# EAGLE design connector_hub (EAGLE 9.2.2)
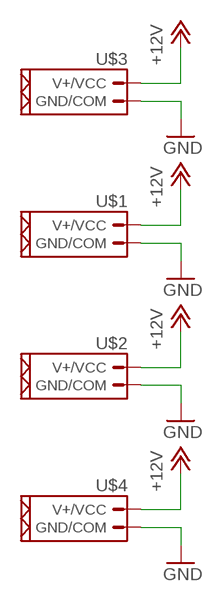
[diagram p0: schematic, sheet 1]

## Parts
U$1  CONN_02_PUIXT60  [XT60]
U$2  CONN_02_PUIXT60  [XT60]
U$3  CONN_02_PUIXT60  [XT60]
U$4  CONN_02_PUIXT60  [XT60]

## Nets
+12V: U$1.P$1(V+/VCC) U$2.P$1(V+/VCC) U$3.P$1(V+/VCC) U$4.P$1(V+/VCC)
GND: U$1.P$2(GND/COM) U$2.P$2(GND/COM) U$3.P$2(GND/COM) U$4.P$2(GND/COM)

## Library data of the parts
U$1-U$4 = OPENBOT:CONN_02_PUI

## Board
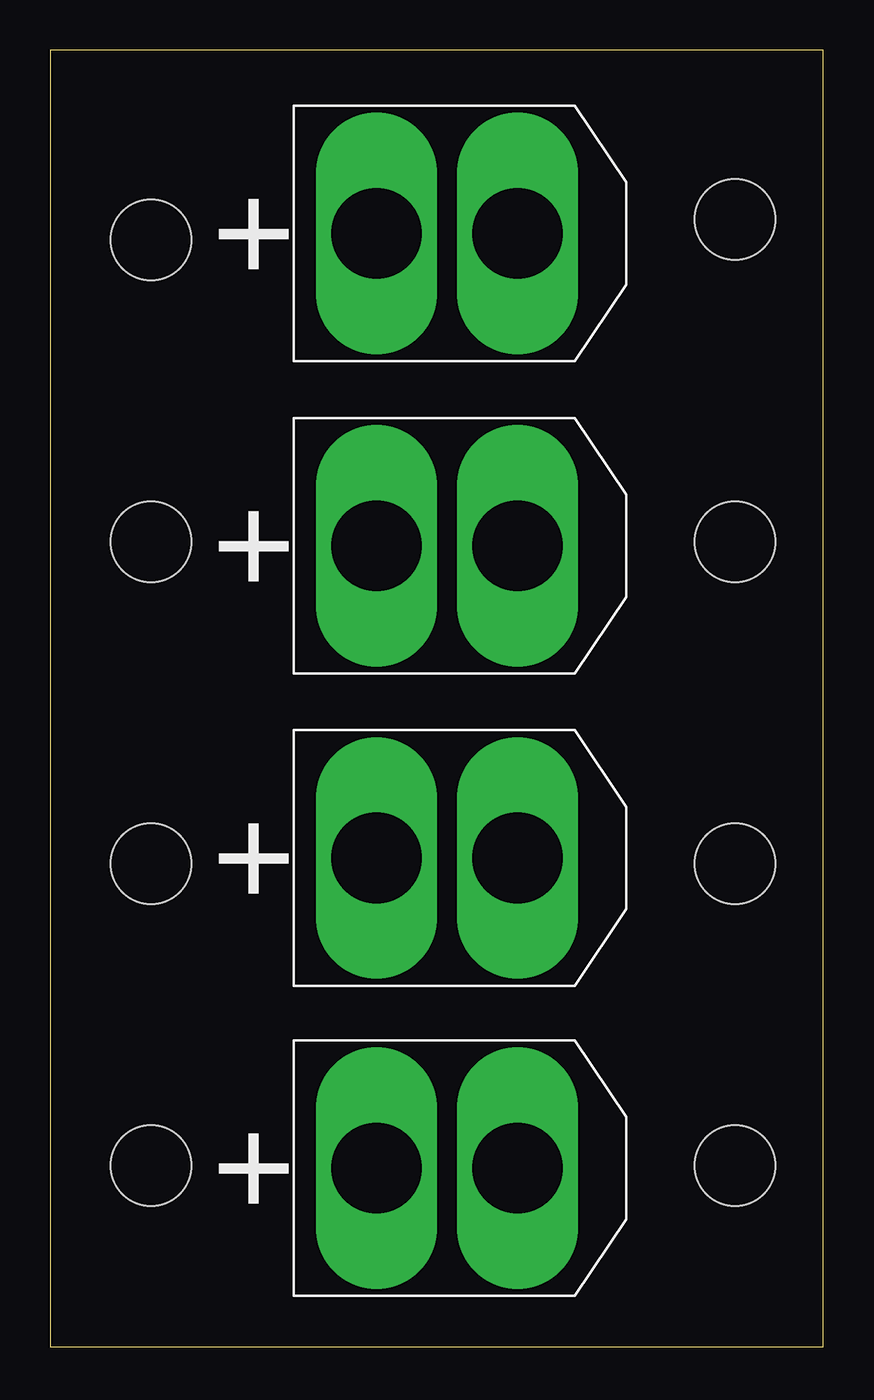
[diagram p1: board, top side]
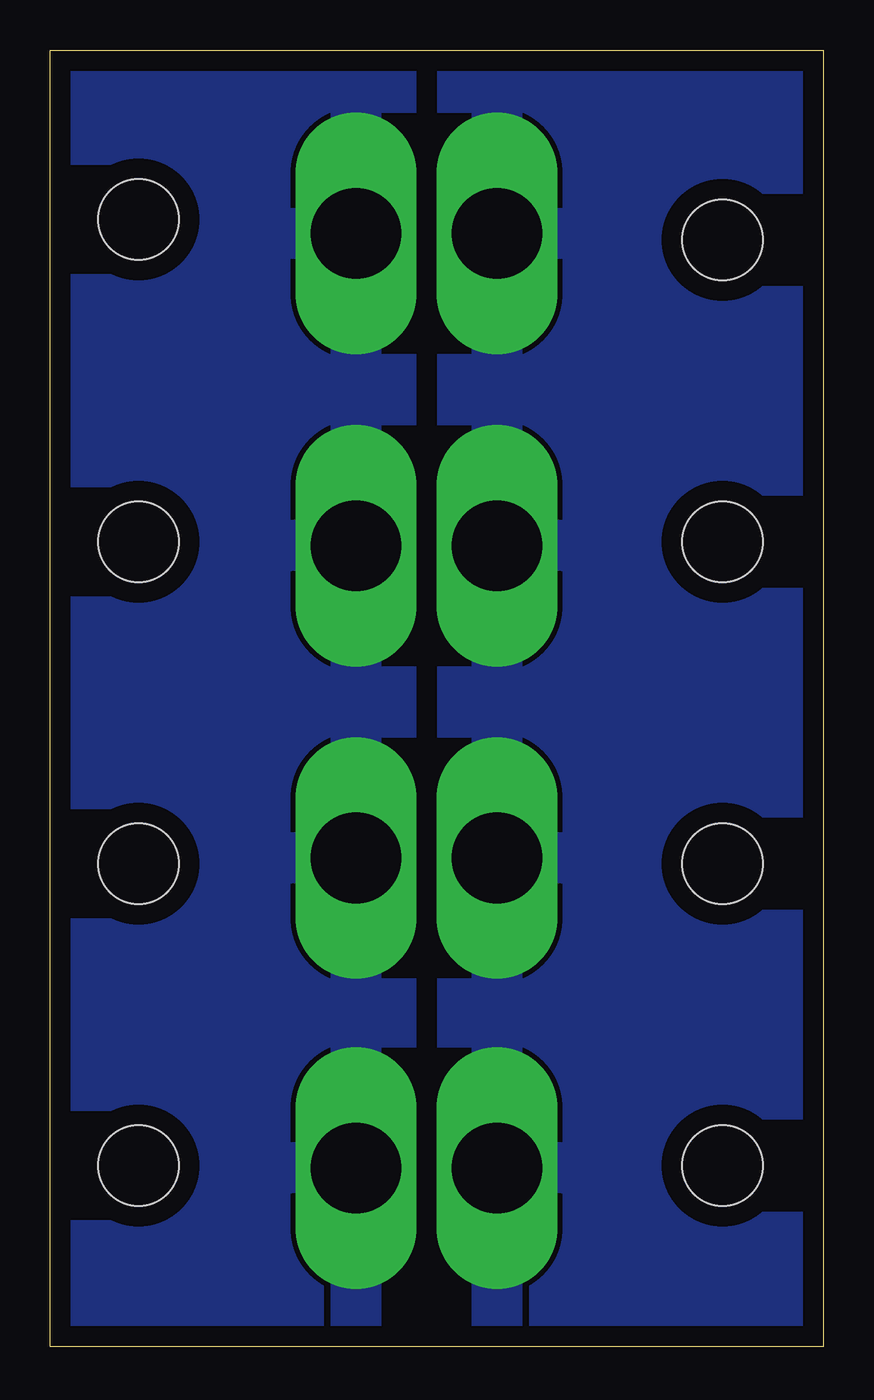
[diagram p2: board, bottom side, seen from below]

Size 38.38 x 64.41 mm. Coordinates in mm from the lower left corner, seen from the top.
Outline: 0,0 38.38,0 38.38,64.41 0,64.41 0,0
Copper layers (1*16): Top 0.035mm / dielectric 1.5mm / Bottom 0.035mm
Design rules "default *": minimum track width 12mil, minimum drill 0.35mm, track to track 15mil, track to pad 15mil, pad to pad 15mil, via to via 15mil, smd to smd 6mil, copper to edge 40mil, drill to drill 15mil, minimum pad ring 10mil, minimum via ring 8mil, stop-mask expansion 4mil, vias tented up to drill 0mil, thermal gap 10mil
Holes 4 mm at 5,9 34,56 34,24 5,40 34,40 5,55 34,9 5,24

### Footprints (pad centres in the part's own frame; a part is rotated, then mirrored left to right if it is on the bottom)
XT60 = drill 4.5 pad 6 long: P$1 -3.5,0; P$2 3.5,0

### Placement (x,y rotation side)
U$1  19.7,8.89 0 top
U$2  19.7,24.29 0 top
U$3  19.7,39.8 0 top
U$4  19.7,55.31 0 top

### Tracks (layer width: path | path; a pad name or v marks a point on that pad's centre or on a via)
+12V
  pour Bottom: -22.52,71.01 17.92,71.01 17.92,-3.27 -22.52,-3.27
GND
  pour Bottom: 78.67,70.28 21.48,70.28 21.48,-2.54 78.67,-2.54